# EAGLE design indoor_nearhandle_module (EAGLE 9.6.2)
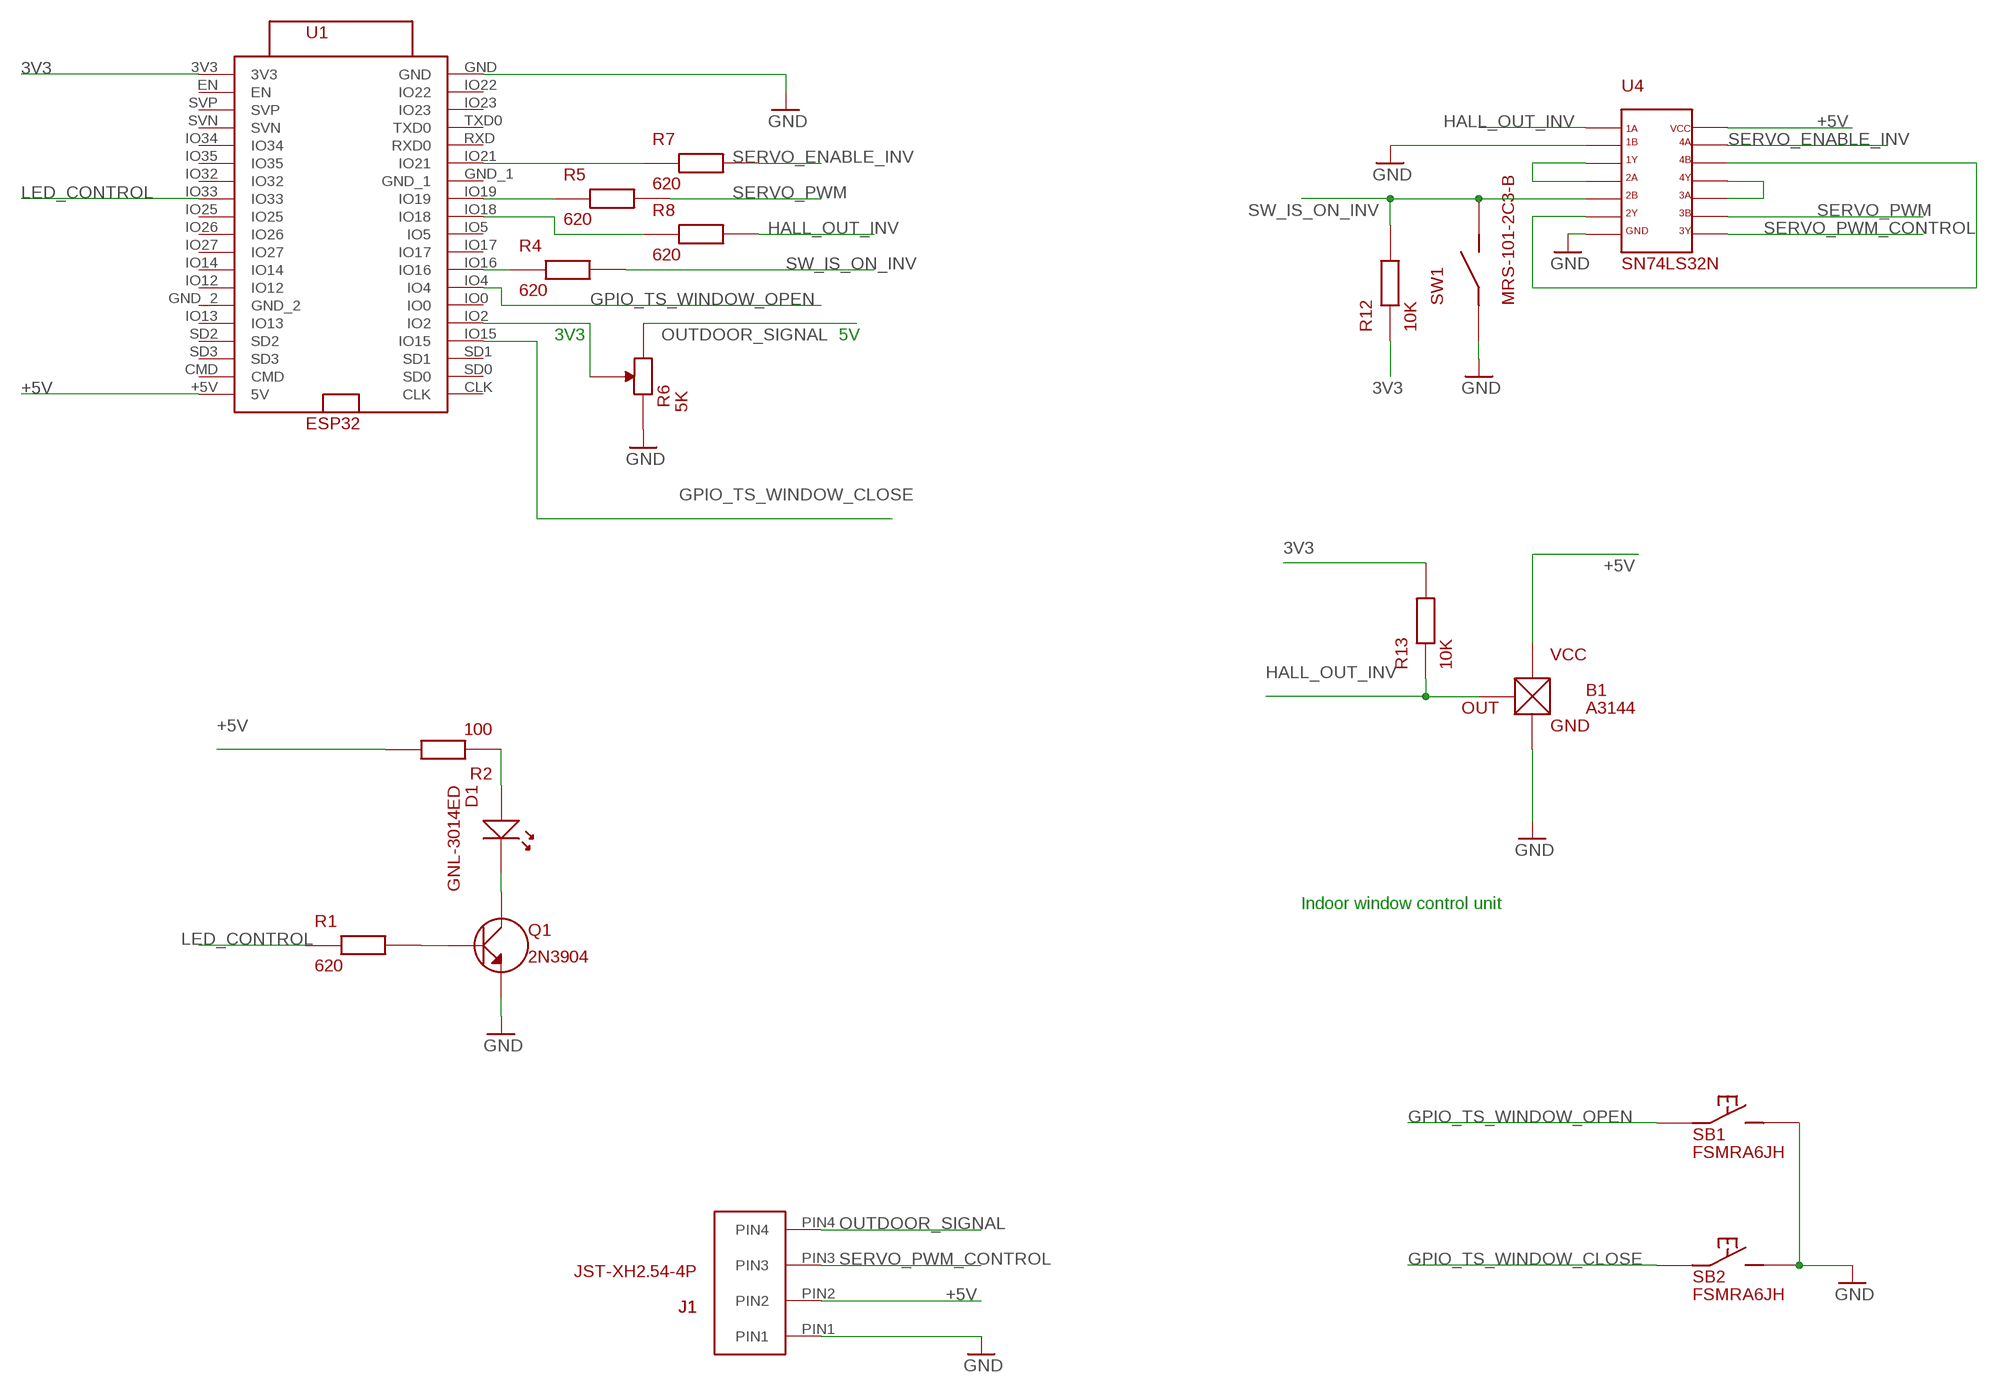
[diagram p0: schematic, sheet 1]

## Parts
B1  A3144  HALL_SENSOR  [HALL_SENSOR]
D1  GNL-3014ED  LD  [LD]
J1  JST-XH2.54-4P  JST-XH254-4P  [JST-XH254-4P]
Q1  2N3904  TRANSISTOR_NPN  [TRANSISTOR]
R1  620  R  [R]
R2  100  R  [R]
R4  620  R  [R]
R5  620  R  [R]
R6  5K  RD  [RD-3362H]
R7  620  R  [R]
R8  620  R  [R]
R12  10K  R  [R]
R13  10K  R  [R]
SB1  FSMRA6JH  SB-NO  [SB-NO-SPST-ANGLE]
SB2  FSMRA6JH  SB-NO  [SB-NO-SPST-ANGLE]
SW1  MRS-101-2C3-B  SWITCH  [SWITCH]
U1  ESP32  [ESP32]
U4  SN74LS32N  [DIP14]

## Nets
3V3: R12.P$1 R13.P$2 U1.3V3
+5V: B1.VCC J1.PIN2 R2.P$2 U1.+5V(5V) U4.PIN_14(VCC)
GND: B1.GND J1.PIN1 Q1.E R6.P1 SB1.B SB2.B SW1.P$1 U1.GND U4.PIN_2(1B) U4.PIN_7(GND)
GPIO_TS_WINDOW_CLOSE: SB2.A U1.IO15
GPIO_TS_WINDOW_OPEN: SB1.A U1.IO4
HALL_OUT_INV: B1.OUT R8.P$2 R13.P$1 U4.PIN_1(1A)
LED_CONTROL: R1.P$1 U1.IO33
N$3: U4.PIN_6(2Y) U4.PIN_12(4B)
N$5: Q1.B R1.P$2
N$6: R5.P$1 U1.IO19
N$7: D1.PIN_ANODE Q1.C
N$8: D1.PIN_CATHODE R2.P$1
N$13: R6.P3 U1.IO2
N$28: R7.P$1 U1.IO21
N$29: R8.P$1 U1.IO18
N$32: R4.P$1 U1.IO16
N$52: U4.PIN_10(3A) U4.PIN_11(4Y)
N$56: U4.PIN_3(1Y) U4.PIN_4(2A)
OUTDOOR_SIGNAL: J1.PIN4 R6.P2
SERVO_ENABLE_INV: R7.P$2 U4.PIN_13(4A)
SERVO_PWM: R5.P$2 U4.PIN_9(3B)
SERVO_PWM_CONTROL: J1.PIN3 U4.PIN_8(3Y)
SW_IS_ON_INV: R4.P$2 R12.P$2 SW1.P$2 U4.PIN_5(2B)
Unconnected: U1.CLK U1.CMD U1.EN U1.GND_1 U1.GND_2 U1.IO0 U1.IO5 U1.IO12 U1.IO13 U1.IO14 U1.IO17 U1.IO22 U1.IO23 U1.IO25 U1.IO26 U1.IO27 U1.IO32 U1.IO34 U1.IO35 U1.RXD(RXD0) U1.SD0 U1.SD1 U1.SD2 U1.SD3 U1.SVN U1.SVP U1.TXD0

## Notes on the sheet
- 3V3 | 5V
- Indoor window control unit

## Library data of the parts
B1 = my_devices:HALL_SENSOR
D1 = my_devices:LD
J1 = my_devices:JST-XH254-4P
Q1 = my_devices:TRANSISTOR_NPN
R1 R2 R4 R5 R7 R8 R12 R13 = my_devices:R
R6 = my_devices:RD
SB1 SB2 = my_devices:SB-NO
SW1 = my_devices:SWITCH
U1 = my_devices:ESP32
U4 = my_devices:SN74LS32N

## Board
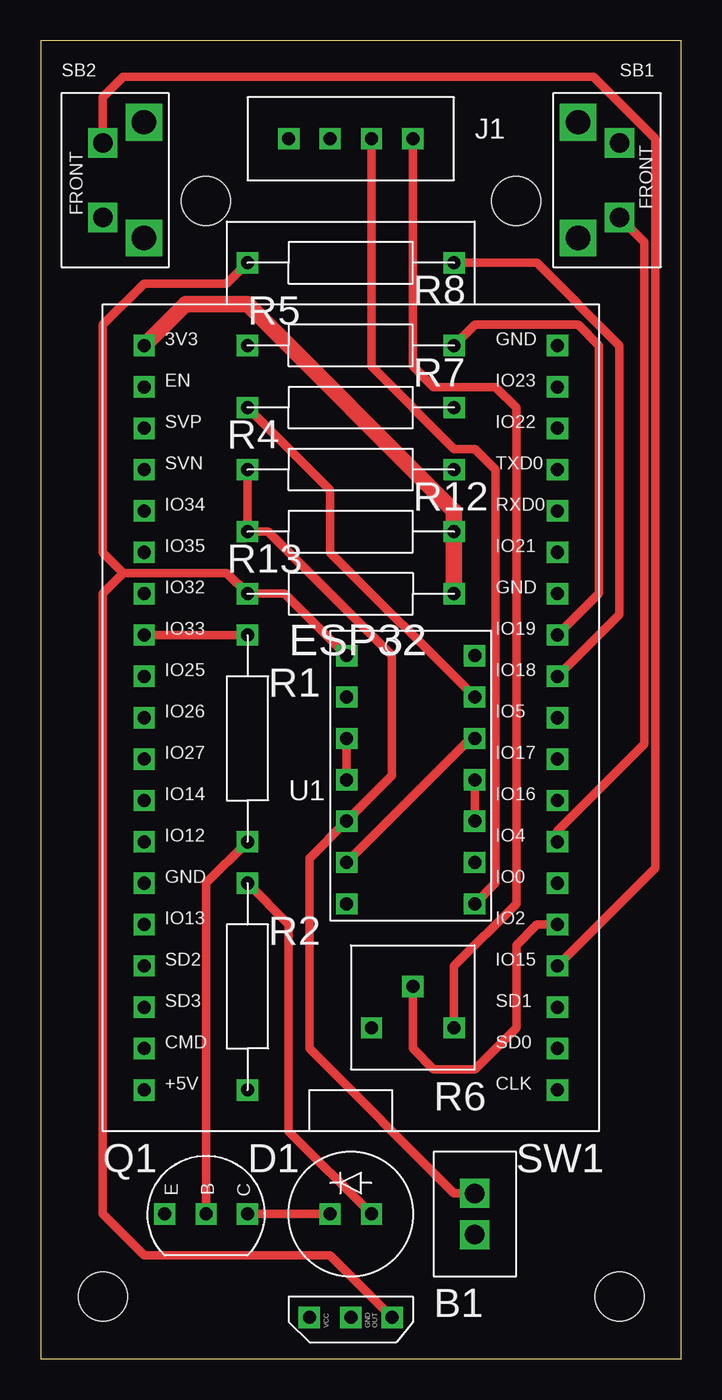
[diagram p1: board, top side]
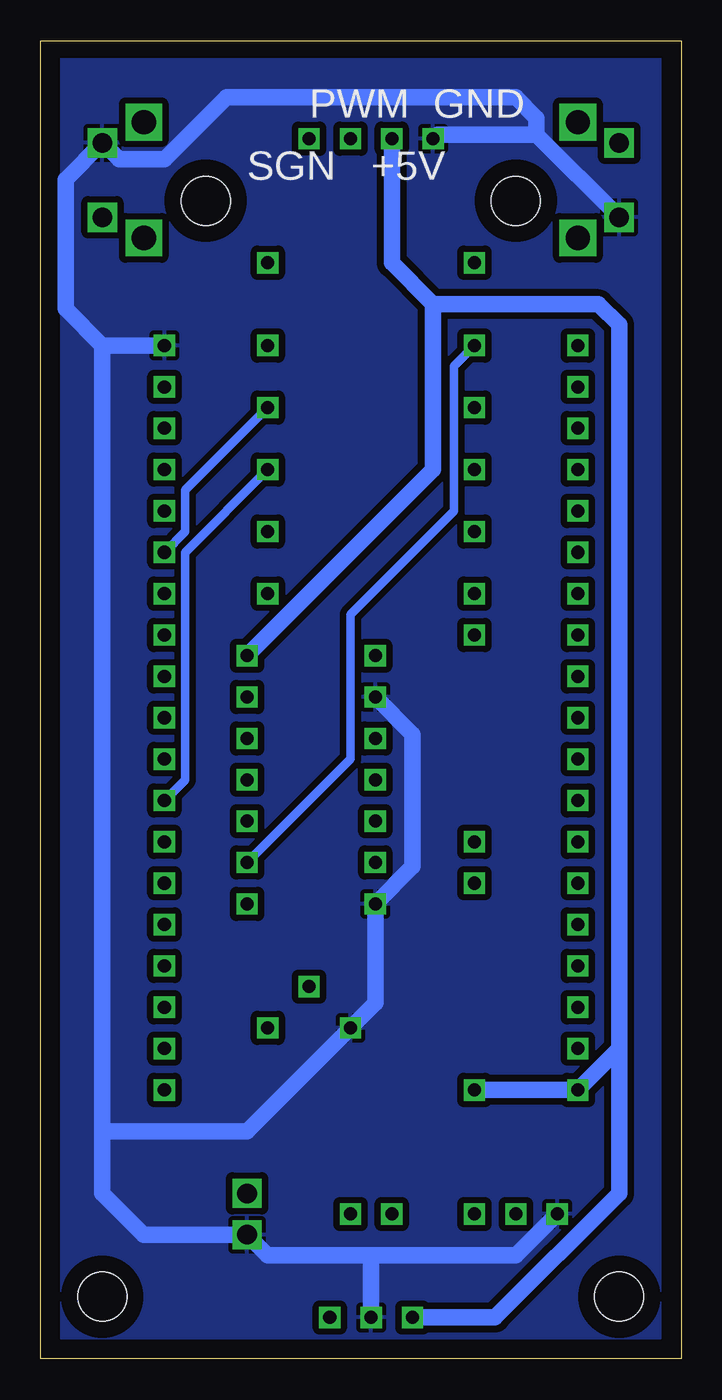
[diagram p2: board, bottom side, seen from below]

Size 39.35 x 80.95 mm. Coordinates in mm from the lower left corner, seen from the top.
Outline: 0,0 39.35,0 39.35,80.95 0,80.95 0,0
Copper layers (1*16): Top 0.035mm / dielectric 1.5mm / Bottom 0.035mm
Design rules "default": minimum track width 6mil, minimum drill 0.35mm, track to track 6mil, track to pad 6mil, pad to pad 6mil, via to via 6mil, smd to smd 6mil, copper to edge 40mil, drill to drill 6mil, minimum pad ring 10mil, minimum via ring 8mil, stop-mask expansion 4mil, vias tented up to drill 0mil, thermal gap 10mil
Holes 3 mm at 29.21,71.12 10.16,71.12 3.81,3.81 35.56,3.81

### Footprints (pad centres in the part's own frame; a part is rotated, then mirrored left to right if it is on the bottom)
HALL_SENSOR = drill 0.8 square: GND 0,0; OUT 0,-2.54; VCC 0,2.54
LD = drill 0.8 square: PIN_ANODE 1.27,0; PIN_CATHODE -1.27,0
JST-XH254-4P = drill 0.8 square: PIN1 -3.81,0; PIN2 -1.27,0; PIN3 1.27,0; PIN4 3.81,0
TRANSISTOR = drill 0.8 square: B 1.27,1.27; C 1.27,3.81; E 1.27,-1.27
R = drill 0.8 square: P$1 -6.35,0; P$2 6.35,0
RD-3362H = drill 0.8 square: P1 -2.54,-1.27; P2 2.54,-1.27; P3 0,1.27
SB-NO-SPST-ANGLE = drill 1.2 square: A -2.286,0; B 2.286,0 | drill 1.5 square: NC1 -3.556,2.54; NC2 3.556,2.54
SWITCH = drill 1.2 square: P$1 -1.27,0; P$2 1.27,0
ESP32 = drill 0.8 square: 3V3 -12.7,22.86; +5V -12.7,-22.86; CLK 12.7,-22.86; CMD -12.7,-20.32; EN -12.7,20.32; GND 12.7,22.86; GND_1 12.7,7.62; GND_2 -12.7,-10.16; IO0 12.7,-10.16; IO2 12.7,-12.7; IO4 12.7,-7.62; IO5 12.7,0; IO12 -12.7,-7.62; IO13 -12.7,-12.7; IO14 -12.7,-5.08; IO15 12.7,-15.24; IO16 12.7,-5.08; IO17 12.7,-2.54; IO18 12.7,2.54; IO19 12.7,5.08; IO21 12.7,10.16; IO22 12.7,17.78; IO23 12.7,20.32; IO25 -12.7,2.54; IO26 -12.7,0; IO27 -12.7,-2.54; IO32 -12.7,7.62; IO33 -12.7,5.08; IO34 -12.7,12.7; IO35 -12.7,10.16; RXD 12.7,12.7; SD0 12.7,-20.32; SD1 12.7,-17.78; SD2 -12.7,-15.24; SD3 -12.7,-17.78; SVN -12.7,15.24; SVP -12.7,17.78; TXD0 12.7,15.24
DIP14 = drill 0.8 square: PIN_1 -4.064,7.62; PIN_2 -4.064,5.08; PIN_3 -4.064,2.54; PIN_4 -4.064,0; PIN_5 -4.064,-2.54; PIN_6 -4.064,-5.08; PIN_7 -4.064,-7.62; PIN_8 3.81,-7.62; PIN_9 3.81,-5.08; PIN_10 3.81,-2.54; PIN_11 3.81,0; PIN_12 3.81,2.54; PIN_13 3.81,5.08; PIN_14 3.81,7.62

### Placement (x,y rotation side)
B1  19.05,2.54 90 top
D1  19.05,8.89 180 top
J1  19.05,74.93 0 top
Q1  8.89,10.16 270 top
R1  12.7,38.1 270 top
R2  12.7,22.86 270 top
R4  19.05,54.61 180 top
R5  19.05,62.23 180 top
R6  22.86,21.59 0 top
R7  19.05,58.42 180 top
R8  19.05,67.31 180 top
R12  19.05,50.8 180 top
R13  19.05,46.99 0 top
SB1  35.56,72.39 90 top
SB2  3.81,72.39 270 top
SW1  26.67,8.89 90 top
U1  19.05,39.37 0 top
U4  22.86,35.56 0 top

### Tracks (layer width: path | path; a pad name or v marks a point on that pad's centre or on a via)
3V3
  Top 1.016: U1.3V3 8.89,64.77 12.7,64.77 25.4,52.07 R12.P$1 R13.P$2
+5V
  Bottom 1.016: 3.81,19.05 3.81,63.5 5.08,64.77 15.24,64.77 | 3.81,19.05 U1.+5V R2.P$2 | U4.PIN_14 15.24,54.61 15.24,64.77 | B1.VCC 11.43,2.54 3.81,10.16 3.81,19.05 | 15.24,64.77 17.78,67.31 J1.PIN2
GND
  Bottom 1.016: U4.PIN_2 16.51,38.35 16.51,30.23 U4.PIN_7 18.8,21.84 R6.P1 26.67,13.97 35.56,13.97 | 35.56,13.97 35.56,10.16 33.02,7.62 SW1.P$1 25.4,6.35 19.05,6.35 | 35.56,62.23 35.56,13.97 | U1.GND 35.56,62.23 | 19.05,6.35 10.16,6.35 Q1.E | 19.05,6.35 B1.GND | SB2.B 8.89,75.18 | 8.89,75.18 8.89,76.2 10.16,77.47 27.94,77.47 31.75,73.66 34.54,73.66 SB1.B 37.83,72.41 37.83,64.5 35.56,62.23 | 8.89,75.18 14.99,75.18 J1.PIN1
  pour Bottom (isolate 0.406): 1.27,80.01 38.1,80.01 38.1,1.27 1.27,1.27
GPIO_TS_WINDOW_CLOSE
  Top 0.508: U1.IO15 37.75,30.13 37.75,74.93 33.94,78.74 5.08,78.74 3.81,77.47 SB2.A
GPIO_TS_WINDOW_OPEN
  Top 0.508: U1.IO4 31.75,32.41 37.09,37.75 37.09,68.57 SB1.A
HALL_OUT_INV
  Top 0.508: U4.PIN_1 14.99,46.99 R13.P$1 11.43,48.26 5.08,48.26 | R8.P$2 11.43,66.04 6.35,66.04 3.81,63.5 3.81,49.53 5.08,48.26 | B1.OUT 17.78,6.35 6.35,6.35 3.81,8.89 3.81,46.99 5.08,48.26
LED_CONTROL
  Top 0.508: U1.IO33 R1.P$1
N$3
  Top 0.508: U4.PIN_6 26.42,38.1 U4.PIN_12
N$5
  Top 0.508: Q1.B 10.16,29.21 R1.P$2
N$6
  Top 0.508: R5.P$1 26.67,63.5 33.02,63.5 34.29,62.23 34.29,46.99 U1.IO19
N$7
  Top 0.508: Q1.C D1.PIN_ANODE
N$8
  Top 0.508: D1.PIN_CATHODE 15.24,13.97 15.24,26.67 R2.P$1
N$13
  Top 0.508: R6.P3 22.86,19.05 24.13,17.78 26.67,17.78 29.21,20.32 29.21,25.4 30.48,26.67 U1.IO2
N$28
  Bottom 0.508: R7.P$1 30.48,53.34 30.48,50.8 U1.IO21
N$29
  Top 0.508: U1.IO18 35.56,45.72 35.56,62.23 30.48,67.31 R8.P$1
N$32
  Bottom 0.508: U1.IO16 30.48,35.56 30.48,49.53 R4.P$1
N$52
  Top 0.508: U4.PIN_10 U4.PIN_11
N$56
  Top 0.508: U4.PIN_4 U4.PIN_3
OUTDOOR_SIGNAL
  Top 0.508: R6.P2 25.4,24.13 29.21,27.94 29.21,58.42 27.94,59.69 24.13,59.69 22.86,60.96 J1.PIN4
SERVO_ENABLE_INV
  Top 0.508: U4.PIN_13 17.78,49.53 17.78,53.34 R7.P$2
SERVO_PWM
  Bottom 0.508: U4.PIN_9 20.32,36.83 20.32,45.72 13.97,52.07 13.97,60.96 R5.P$2
SERVO_PWM_CONTROL
  Top 0.508: U4.PIN_8 27.94,29.21 27.94,54.61 26.67,55.88 25.4,55.88 20.32,60.96 J1.PIN3
SW_IS_ON_INV
  Top 0.508: R4.P$2 R12.P$2 13.97,50.8 21.59,43.18 21.59,35.81 U4.PIN_5 16.51,30.73 16.51,19.05 25.4,10.16 SW1.P$2

### Text on the board
tNames: SB2 | SB1 | R8 | R5 | R7 | R4 | R12 | R13 | R1 | R2 | R6 | Q1 | D1 | SW1 | B1
bNames: GND | PWM | +5V | SGN